# Altium schematic sheet LCDTFT_CTP_FPC6P_10.1INCH_ER-TPC101-1.SchDoc
size A3; SheetNumber: 23; SheetTotal: 27
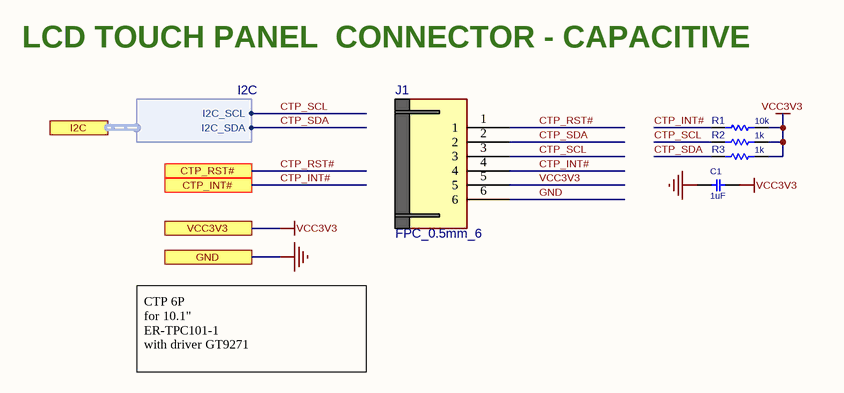
[diagram p0: LCDTFT_CTP_FPC6P_10.1INCH_ER-TPC101-1.SchDoc]

## Parts
C1  1uF  [C0402]
J1  FPC_0.5mm_6  [FPC50_6]
R1  10k  [R0402]
R2  1k  [R0402]
R3  1k  [R0402]

## Ports
CTP_INT#, CTP_RST#, GND, I2C (harness I2C), VCC3V3

## Harnesses
I2C: I2C_SCL, I2C_SDA

## Nets
GND: C1.2 J1.6 ; port GND
VCC3V3: C1.1 J1.5 R1.2 R2.2 R3.2 ; port VCC3V3
CTP_INT#: J1.4 R1.1 ; port CTP_INT#
CTP_RST#: J1.1 ; port CTP_RST#
CTP_SCL: J1.3 R2.1 ; port I2C.I2C_SCL
CTP_SDA: J1.2 R3.1 ; port I2C.I2C_SDA

## Notes on the sheet
- LCD TOUCH PANEL  CONNECTOR - CAPACITIVE
- CTP 6P
  for 10.1"
  ER-TPC101-1
  with driver GT9271

## Library data of the parts
C1 = CAP_SMD_MLCC: CAP, MLCC; PARAM: X5R, 10%; MANF_P#: CL05A105KO5NNND; MANF: Samsung; PARAM2: 16v; PRICE: 50,000:	$0.006; ASSEMBLY: ASSEMBLY; VALUE: 1uF
J1 = FPC50_6: CONN, FPC, 0.50mm pitch, RightAngle, Bot. Contact, Hinge type; MANF: FCI; MANF_P#: SFV6R1STBE1HLF; VALUE: FPC_0.5mm_6
R1-R3 = RES_SMD: RESISTOR, SMD; PARAM: 0.063W; DESC: DESCRIPTION; DIST#: MOUSER; PARAM2: 1%; MANF_P#: -; MANF: -; ASSEMBLY: ASSEMBLY; PRICE: 100= 0.3$
  R1: VALUE: 10k
  R2 R3: VALUE: 1k